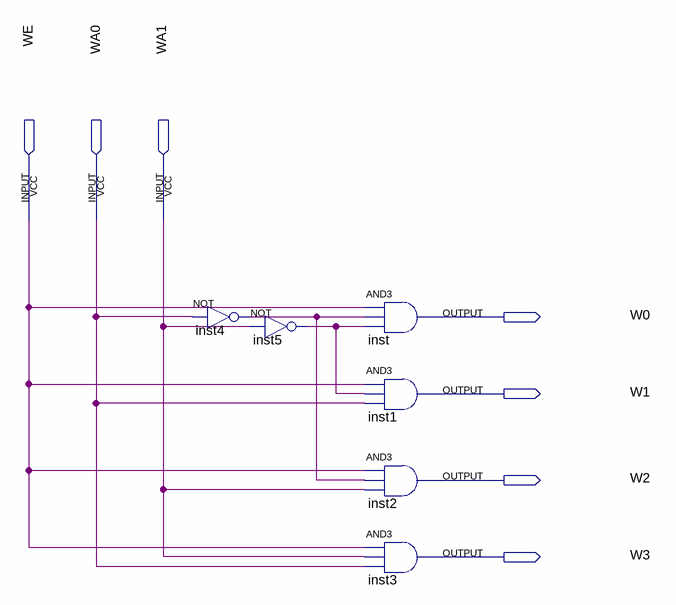
[diagram p0: schematic sheet]
// Quartus schematic 2to4WD.bdf as structural Verilog: 6 symbols, 7 pins
module \2to4WD  (
  input  WE,
  input  WA0,
  input  WA1,
  output W0,
  output W1,
  output W2,
  output W3
);

  wire inst4_out, inst5_out;

  not inst4 (inst4_out, WA0);
  not inst5 (inst5_out, WA1);
  and inst (W0, WE, inst4_out, inst5_out);
  and inst1 (W1, WE, inst5_out, WA0);
  and inst2 (W2, WE, inst4_out, WA1);
  and inst3 (W3, WE, WA1, WA0);
endmodule
